# Altium schematic sheet rs485_transceiver.SchDoc: RS485 Transceiver
size A4; DocumentNumber: 4; SheetNumber: 4; SheetTotal: 11
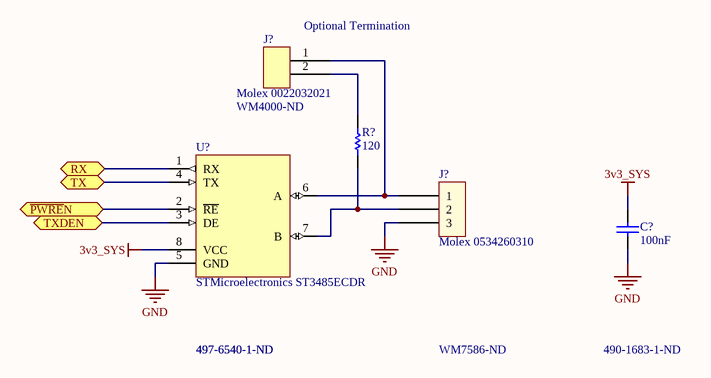
[diagram p0: rs485_transceiver.SchDoc]

## Parts
(Parts that share a designator on the sheet are numbered #1, #2 ... from top to bottom, then left to right.)
C?  Capacitance: 100nF  [PCB-3a53f7g8nqmmfsudd9tf-1]  (hidden comment: Murata GRM219R71C104KA01D)
J?#1  Molex 0022032021  [PCB-ayp4uy6mce3kuznu7cpv-1]
J?#2  Molex 0534260310  [PCB-uh5qjayc3e5325ry13yq-1]
R?  Resistance: 120  [PCB-9ahxsq8gddjqcnfjmojj-1]  (hidden comment: Stackpole Electronics RMCF0603FT120R)
U?  STMicroelectronics ST3485ECDR  [PCB-lmrwxhl2h1q3b67kej26-1]

## Ports
RX, TX, TXDEN, ~{PWRE}N

## Nets
3v3_SYS: C?.1 U?.8(VCC)
GND: C?.2 J?#2.3 U?.5(GND)
~{PWRE}N: U?.2(~{RE}) ; port ~{PWRE}N
RX: U?.1(RX) ; port RX
TX: U?.4(TX) ; port TX
TXDEN: U?.3(DE) ; port TXDEN
NetJ?#1_1: J?#1.1 J?#2.1 U?.6(A)
NetJ?#1_2: J?#1.2 R?.2
NetJ?#2_2: J?#2.2 R?.1 U?.7(B)

## Notes on the sheet
- (near J?#1) Optional Termination
- (near J?#1) WM4000-ND
- 497-6540-1-ND
- WM7586-ND
- 490-1683-1-ND
- Title
- Size:
- Date:
- A4
- Engineer:
- Time:
- Sheet
- Revision:
- of
- File:

## Library data of the parts
C? = CMP-f3963a9e29dd2c51-2: 0805 0.1 uF 16 V ±10 % Tolerance X7R Surface Mount Multilayer Ceramic Capacitor; Capacitance Tolerance: ±10%; Case/Package (SI): 2012; Voltage Rating (DC): 16.0 V; Lead-Free Status: Lead Free; OctopartID: f3963a9e29dd2c51; Size-Width: 0.00125 m; Mounting Style: Surface Mount; Octopart URL: http://octopart.com/grm219r71c104ka01d-murata-196397; Size-Thickness: 0.00085 m; Case/Package: 0805; Manufacturer Part Number: GRM219R71C104KA01D; Lifecycle Status: Active; Size-Length: 0.002 m; Size-Height: 0.00085 m; RoHS: Compliant; Dielectric Characteristic: X7R
J?#1 = CMP-db3d12a8237904fa-2: 2.54mm (.100") Pitch KK® Wire-to-Board Header, Single Row, Vertical, 2 Circuits, PA Polyamide Nylon, Tin (Sn) Plating; Number of Positions: 2; Lifecycle Status: Not Listed by Manufacturer; RoHS: Compliant; OctopartID: db3d12a8237904fa; Octopart URL: http://octopart.com/0022032021-molex-10476834; Manufacturer Part Number: 0022032021
J?#2 = CMP-86e74f44d2545920-1: Conn Shrouded Header HDR 3 POS 2.5mm Solder RA Thru-Hole Mini-Lock™ Tray; Mounting Style: Solder; Octopart URL: http://octopart.com/0534260310-molex-11104725; OctopartID: 86e74f44d2545920; Lifecycle Status: Not Listed by Manufacturer; RoHS: Compliant
R? = CMP-7038b8177fceafff-1: Res Thick Film 0603 120 Ohm 1% 0.1W(1/10W) }100ppm/ Molded SMD Automotive Paper T/R; Lead-Free Status: Lead Free; Power Rating: 100 mW; Octopart URL: https://octopart.com/rmcf0603ft120r-stackpole+electronics-19212944; Manufacturer Part Number: RMCF0603FT120R; Case/Package: 0603; Mounting Style: Surface Mount; Packaging: Tape & Reel (TR); Resistance Tolerance: ±1%; RoHS: Compliant; OctopartID: 7038b8177fceafff
U? = CMP-4f81868cdec19046-5: ST3485E Series 3.3 V ±15 kV ESD Protected RS-485/RS-422 Transceiver - SOIC-8; Data Rate: 15.0 Mbps; Supply Current: 2.20 mA; Lead-Free Status: Lead Free; Supply Voltage (DC): 3.00 V (min); RoHS: Compliant; Case/Package: SOIC; Mounting Style: Surface Mount; Manufacturer Part Number: ST3485ECDR; REACH SVHC Compliance: No SVHC; Packaging: Cut Tape (CT); Lifecycle Status: Active; OctopartID: 4f81868cdec19046; Number of Pins: 8; Octopart URL: http://octopart.com/st3485ecdr-stmicroelectronics-504870